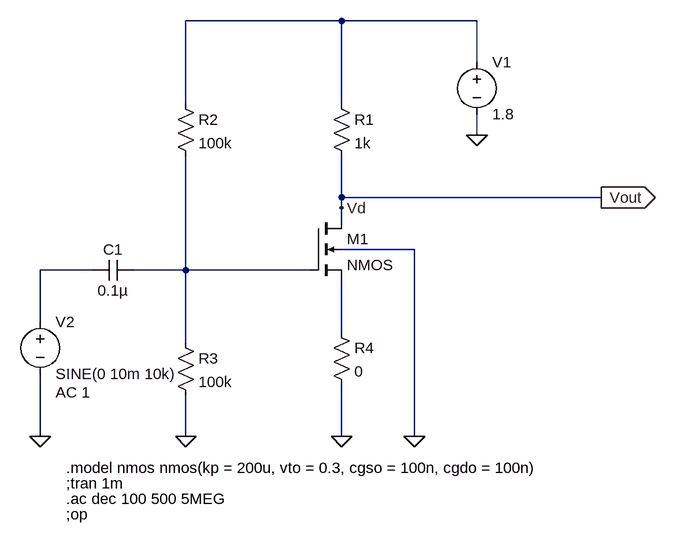
[diagram p0: schematic Amplifier.asc]
Amplifier.asc, the LTspice schematic file:
Version 4
SHEET 1 880 680
WIRE 224 -160 -16 -160
WIRE 432 -160 224 -160
WIRE 432 -96 432 -160
WIRE -16 -32 -16 -160
WIRE 224 -32 224 -160
WIRE 432 16 432 -16
WIRE 224 112 224 48
WIRE 624 112 224 112
WIRE 224 128 224 112
WIRE 224 144 224 128
WIRE 336 192 224 192
WIRE -160 224 -240 224
WIRE -16 224 -16 48
WIRE -16 224 -96 224
WIRE 176 224 -16 224
WIRE -240 304 -240 224
WIRE 224 320 224 240
WIRE -16 336 -16 224
WIRE -240 480 -240 384
WIRE -16 480 -16 416
WIRE 224 480 224 400
WIRE 336 480 336 192
FLAG 432 16 0
FLAG -16 480 0
FLAG 224 480 0
FLAG 336 480 0
FLAG -240 480 0
FLAG 224 128 Vd
FLAG 624 112 Vout
IOPIN 624 112 Out
SYMBOL nmos4 176 144 R0
SYMATTR InstName M1
SYMATTR Value2 l=1u w=25u
SYMBOL voltage 432 -112 R0
WINDOW 123 0 0 Left 0
WINDOW 39 0 0 Left 0
SYMATTR InstName V1
SYMATTR Value 1.8
SYMBOL res 208 -48 R0
SYMATTR InstName R1
SYMATTR Value 1k
SYMBOL res -32 -48 R0
SYMATTR InstName R2
SYMATTR Value 100k
SYMBOL res -32 320 R0
SYMATTR InstName R3
SYMATTR Value 100k
SYMBOL res 208 304 R0
SYMATTR InstName R4
SYMATTR Value 0
SYMBOL voltage -240 288 R0
WINDOW 123 24 124 Left 2
WINDOW 39 0 0 Left 0
SYMATTR Value2 AC 1
SYMATTR InstName V2
SYMATTR Value SINE(0 10m 10k)
SYMBOL cap -96 208 R90
WINDOW 0 0 32 VBottom 2
WINDOW 3 32 32 VTop 2
SYMATTR InstName C1
SYMATTR Value 0.1µ
TEXT -200 528 Left 2 !.model nmos nmos(kp = 200u, vto = 0.3, cgso = 100n, cgdo = 100n)
TEXT -200 552 Left 2 !;tran 1m
TEXT -200 576 Left 2 !.ac dec 100 500 5MEG
TEXT -200 600 Left 2 !;op

The netlist it stands for:
* Amplifier.asc
M1 Vout N003 N004 0 NMOS l=1u w=25u
V1 N001 0 1.8
R1 N001 Vout 1k
R2 N001 N003 100k
R3 N003 0 100k
R4 N004 0 0
V2 N002 0 SINE(0 10m 10k) AC 1
C1 N003 N002 0.1µ
.model NMOS NMOS
.model PMOS PMOS
.lib standard.mos
.model nmos nmos(kp = 200u, vto = 0.3, cgso = 100n, cgdo = 100n)
;tran 1m
.ac dec 100 500 5MEG
;op
.backanno
.end